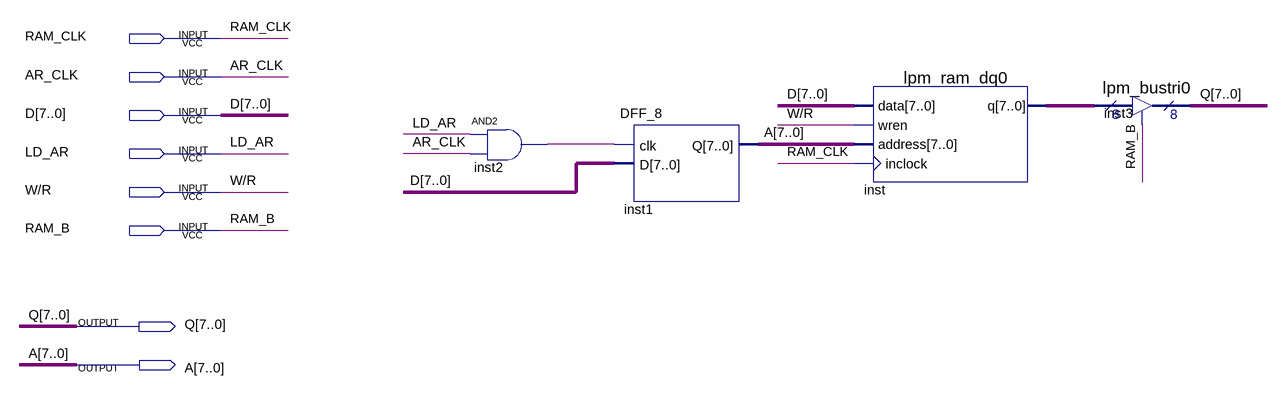
[diagram p0: schematic sheet]
// Quartus schematic RAM.bdf as structural Verilog: 4 symbols, 8 pins
module RAM (
  input  RAM_CLK,
  input  AR_CLK,
  input  [7:0] D,
  input  LD_AR,
  input  \W/R ,
  input  RAM_B,
  output [7:0] Q,
  output [7:0] A
);

  wire inst2_out;
  wire [7:0] inst_q;

  and inst2 (inst2_out, LD_AR, AR_CLK);
  DFF_8 inst1 (.clk(inst2_out), .D(D), .Q(A));
  lpm_ram_dq0 inst (.data(D), .wren(\W/R ), .address(A), .inclock(RAM_CLK), .q(inst_q));
  lpm_bustri0 inst3 (.enabledt(RAM_B), .data(inst_q), .tridata(Q));
endmodule
